# Altium schematic sheet 按键采集CAN.SchDoc
size A4; SheetNumber: 1; SheetTotal: 1
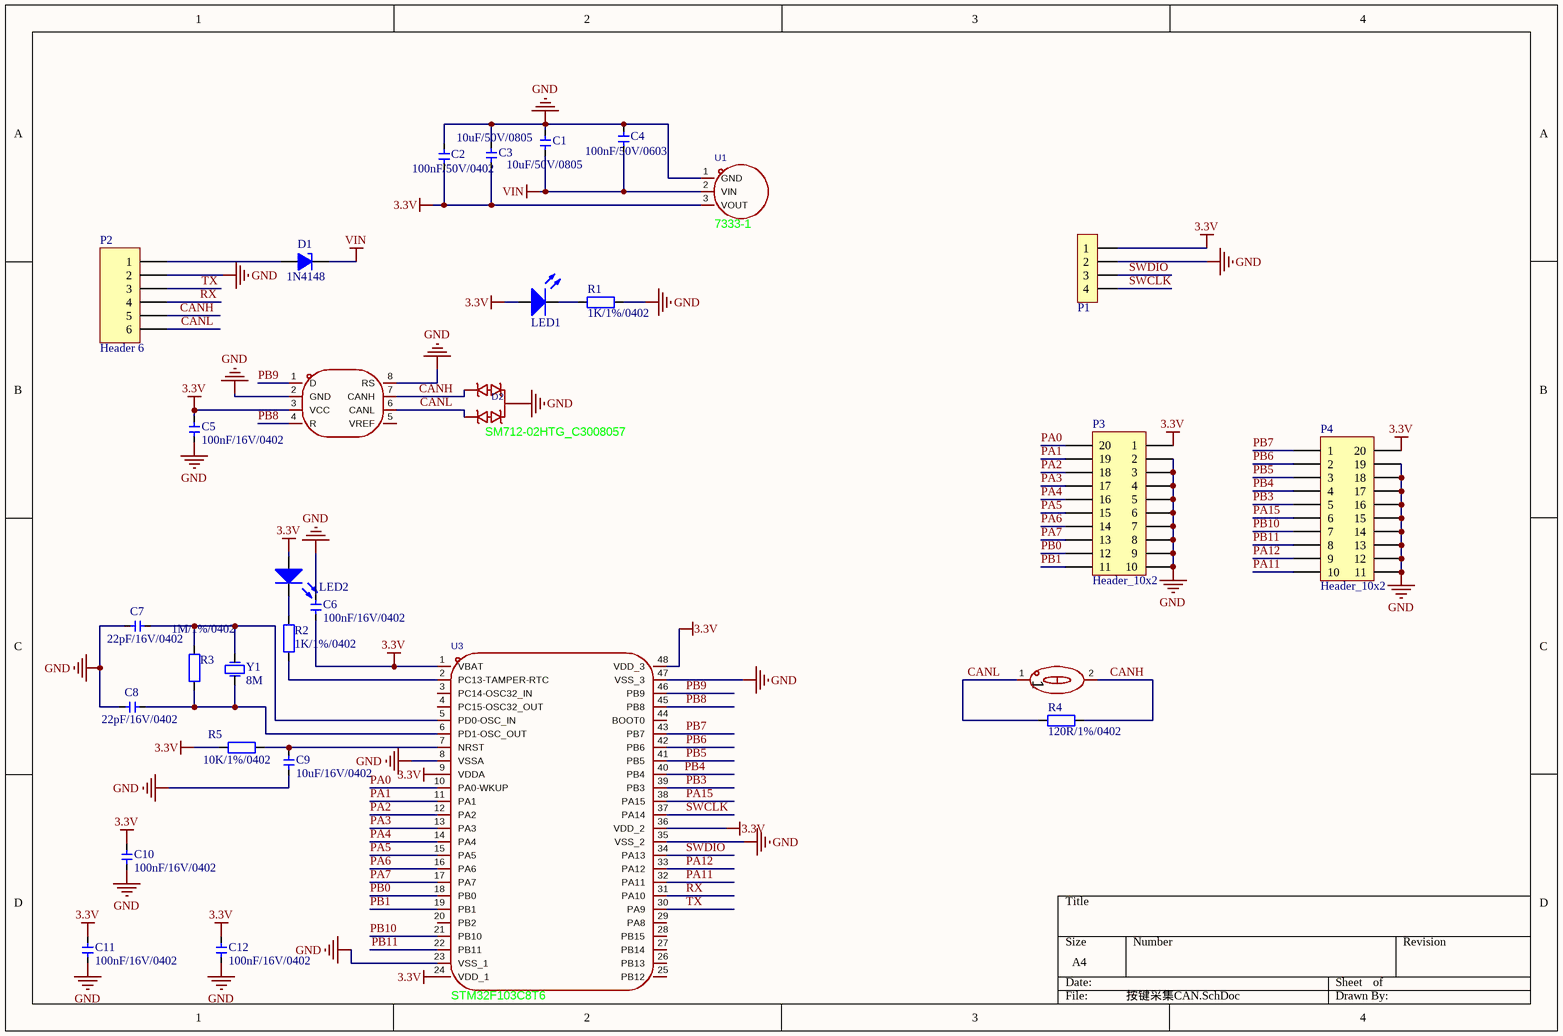
[diagram p0: 按键采集CAN.SchDoc]

## Parts
C1  10uF/50V/0805  [CAP-0805]
C2  100nF/50V/0402  [0402]
C3  10uF/50V/0805  [CAP-0805]
C4  100nF/50V/0603  [CAP-0603]
C5  100nF/16V/0402  [cap-0402]
C6  100nF/16V/0402  [cap-0402]
C7  22pF/16V/0402  [cap-0402]
C8  22pF/16V/0402  [cap-0402]
C9  10uF/16V/0402  [cap-0402]
C10  100nF/16V/0402  [cap-0402]
C11  100nF/16V/0402  [cap-0402]
C12  100nF/16V/0402  [cap-0402]
D1  1N4148  [SOD-123]
D2  SM712-02HTG_C3008057  [SOT-23-3_L2.9-W1.3-P1.90-LS2.4-BR]
LED1  red  [LED_0603]  (value not drawn)
LED2  green  [LED_0603]  (value not drawn)
P1  Header 4  [HDR-SMD_4P-P2.54-H-M-W13.3-N]  (value not drawn)
P2  Header 6  [CONN-TH_6P-P2.50_HC-XH-6AW-G]
P3  Header_10x2  [HDR-TH_20P-P2.54-V-M-R2-C10-S2.54]
P4  Header_10x2  [HDR-TH_20P-P2.54-V-M-R2-C10-S2.54]
R1  1K/1%/0402  [r0402]
R2  1K/1%/0402  [r0402]
R3  1M/1%/0402  [r0402]
R4  120R/1%/0402  [r0402]
R5  10K/1%/0402  [r0402]
SW1  DSIC01LS-P_C600988  [SW-SMD_2P-L3.5-W6.1-P2.54-LS9.8]  (value not drawn)
U1  7333-1  [SOT89]
U2  SN65HVD230DR  [SOIC-8_L4.9-W3.9-P1.27-LS6.0-BL]  (value not drawn)
U3  STM32F103C8T6  [LQFP48_STM32F103C]
Y1  value 8M  [CRYSTAL-SMD_L5.0-W3.2]  (hidden comment: TAXM8M2QLFCDT1T)

## Nets
3.3V: C2.1 C3.2 C5.1 C6.2 C10.1 C11.1 C12.1 LED1.1(A) LED2.1(A) P1.1 P3.1 P4.20 R5.2 U1.3(VOUT) U2.3(VCC) U3.1(VBAT) U3.9(VDDA) U3.24(VDD_1) U3.36(VDD_2) U3.48(VDD_3)
GND: C1.2 C2.2 C3.1 C4.2 C5.2 C6.1 C7.2 C8.2 C9.2 C10.2 C11.2 C12.2 D2.3 P1.2 P2.2 P3.2 P3.3 P3.4 P3.5 P3.6 P3.7 P3.8 P3.9 P3.10 P4.11 P4.12 P4.13 P4.14 P4.15 P4.16 P4.17 P4.18 P4.19 R1.1 U1.1(GND) U2.2(GND) U2.8(RS) U3.8(VSSA) U3.23(VSS_1) U3.35(VSS_2) U3.47(VSS_3)
VIN: C1.1 C4.1 D1.2(K) U1.2(VIN)
CANH: D2.1 P2.5 R4.2 SW1.2(PIN2) U2.7(CANH)
CANL: D2.2 P2.6 R4.1 SW1.1(PIN1) U2.6(CANL)
PA0: P3.20 U3.10(PA0-WKUP)
PA1: P3.19 U3.11(PA1)
PA2: P3.18 U3.12(PA2)
PA3: P3.17 U3.13(PA3)
PA4: P3.16 U3.14(PA4)
PA5: P3.15 U3.15(PA5)
PA6: P3.14 U3.16(PA6)
PA7: P3.13 U3.17(PA7)
PA11: P4.10 U3.32(PA11)
PA12: P4.9 U3.33(PA12)
PA15: P4.6 U3.38(PA15)
PB0: P3.12 U3.18(PB0)
PB1: P3.11 U3.19(PB1)
PB3: P4.5 U3.39(PB3)
PB4: P4.4 U3.40(PB4)
PB5: P4.3 U3.41(PB5)
PB6: P4.2 U3.42(PB6)
PB7: P4.1 U3.43(PB7)
PB8: U2.4(R) U3.45(PB8)
PB9: U2.1(D) U3.46(PB9)
PB10: P4.7 U3.21(PB10)
PB11: P4.8 U3.22(PB11)
RX: P2.4 U3.31(PA10)
SWCLK: P1.4 U3.37(PA14)
SWDIO: P1.3 U3.34(PA13)
TX: P2.3 U3.30(PA9)
NetC7_1: C7.1 R3.2 U3.5(PD0-OSC_IN) Y1.1
NetC8_1: C8.1 R3.1 U3.6(PD1-OSC_OUT) Y1.2
NetC9_1: C9.1 R5.1 U3.7(NRST)
NetD1_1: D1.1(A) P2.1
NetLED1_2: LED1.2(K) R1.2
NetLED2_2: LED2.2(K) R2.2
NetR2_1: R2.1 U3.2(PC13-TAMPER-RTC)

Not connected (* = marked no-connect by the designer): U2 5(VREF); U3 3(PC14-OSC32_IN) 4(PC15-OSC32_OUT) 20(PB2) 25(PB12) 26(PB13) 27(PB14) 28(PB15) 29(PA8) 44(BOOT0)

## Library data of the parts
C1-C12 = Cap: 无极性电容; Published: 8-Jun-2000; LatestRevisionDate: 17-Jul-2002; LatestRevisionNote: Re-released for DXP Platform.; PackageReference: RAD-0.3; Publisher: Altium Limited
  C1 C3: Value: 10uF/50V/0805
  C2: Value: 100nF/50V/0402
  C4: Value: 100nF/50V/0603
  C5 C6 C10-C12: Value: 100nF/16V/0402
  C7 C8: Value: 22pF/16V/0402
  C9: Value: 10uF/16V/0402
D1 = Diode-Z: Value: 12V; Published: 8-Jun-2000; LatestRevisionDate: 17-Jul-2002; LatestRevisionNote: Re-released for DXP Platform.; PackageReference: SMB; Publisher: Altium Limited; Code_JEDEC: DO-214-AA
LED1 LED2 = LED: 发光二极管; Published: 8-Jun-2000; LatestRevisionDate: 08-Jul-2005; LatestRevisionNote: Mech Layer 1 removed.; PackageReference: LED-0; Publisher: Altium Limited
P1 = Header 4: 接插件; LatestRevisionDate: 17-Jul-2002; LatestRevisionNote: Re-released for DXP Platform.; Publisher: Altium Limited
P2 = Header 6: Header, 6-Pin; LatestRevisionDate: 17-Jul-2002; LatestRevisionNote: Re-released for DXP Platform.; Publisher: Altium Limited
P3 P4 = Header_10x2: 接插件
R1-R5 = Res: 贴片电阻; Published: 8-Jun-2000; LatestRevisionDate: 17-Jul-2002; LatestRevisionNote: Re-released for DXP Platform.; PackageReference: AXIAL-0.4; Publisher: Altium Limited
  R1 R2: Value: 1K/1%/0402
  R3: Value: 1M/1%/0402
  R4: Value: 120R/1%/0402
  R5: Value: 10K/1%/0402
Y1 = Passive_Crystal_2Pin: 两脚无源晶振; Published: 8-Jun-2000; LatestRevisionDate: 17-Jul-2002; LatestRevisionNote: Re-released for DXP Platform.; PackageReference: R38; Publisher: Altium Limited
D2 = SM712-02HTG_C3008057: Symbol: SM712-02HTG_C3008057
SW1 = DSIC01LS-P_C600988: Symbol: DSIC01LS-P_C600988
U1 = 7333-1: Symbol: 7333-1
U2 = SN65HVD230DR: Symbol: SN65HVD230DR
U3 = STM32F103C8T6: Symbol: STM32F103C8T6